# EAGLE design UKHASnet-avr-sensor (EAGLE 6.5.0)
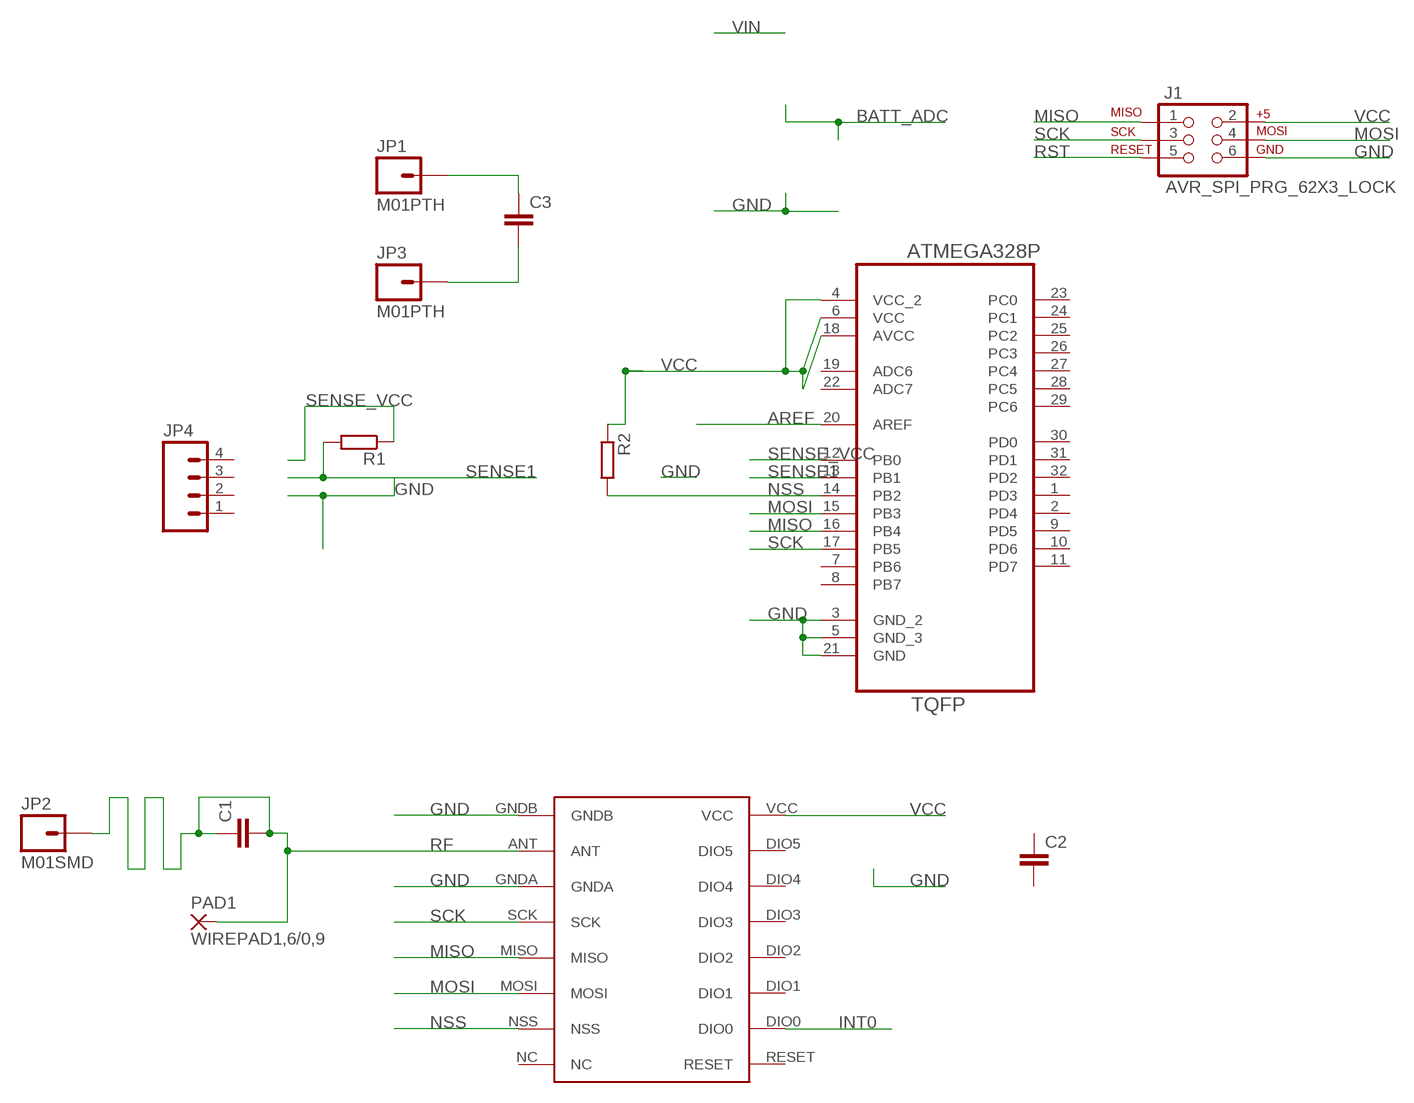
[diagram p0: schematic, sheet 1]

## Parts
C1  C-EUC0402  [C0402]
C2  C-EUC0402  [C0402]
C3  C-EUC0402  [C0402]
J1  AVR_SPI_PRG_62X3_LOCK  [2X3_LOCK]
JP1  M01PTH  [1X01]
JP2  M01SMD  [LUXEON-PAD]
JP3  M01PTH  [1X01]
JP4  M04PTH  [1X04]
PAD1  WIREPAD1,6/0,9  [1,6/0,9]
R1  R-EU_R0402  [R0402]
R2  R-EU_R0402  [R0402]
U2  ATMEGA328P-AU  [QFP80P900X900X120-32N]
U$1  RFM69HW  [RFM]

## Nets
AREF: U2.20(AREF)
GND: C3.2 J1.6 JP3.1 U2.3(GND_2) U2.5(GND_3) U2.21(GND) U$1.GNDA U$1.GNDB
INT0: U$1.DIO0
MISO: J1.1 U2.16(PB4) U$1.MISO
MOSI: J1.4 U2.15(PB3) U$1.MOSI
NSS: R2.2 U2.14(PB2) U$1.NSS
RF [RF]: C1.1 C1.2 JP2.P$1 PAD1.1(P) U$1.ANT
RST: J1.5
SCK: J1.3 U2.17(PB5) U$1.SCK
SENSE1: R1.2 U2.13(PB1)
SENSE_VCC: R1.1 U2.12(PB0)
VCC: C3.1 J1.2 JP1.1 R2.1 U2.4(VCC_2) U2.6(VCC) U2.18(AVCC) U$1.VCC
Unconnected: C2.1 C2.2 JP4.1 JP4.2 JP4.3 JP4.4 U2.1(PD3) U2.2(PD4) U2.7(PB6) U2.8(PB7) U2.9(PD5) U2.10(PD6) U2.11(PD7) U2.19(ADC6) U2.22(ADC7) U2.23(PC0) U2.24(PC1) U2.25(PC2) U2.26(PC3) U2.27(PC4) U2.28(PC5) U2.29(PC6) U2.30(PD0) U2.31(PD1) U2.32(PD2) U$1.DIO1 U$1.DIO2 U$1.DIO3 U$1.DIO4 U$1.DIO5 U$1.NC U$1.RESET

## Library data of the parts
C1 C2 = resistor:C-EU: CAPACITOR, European symbol
C3 = rcl:C-EU: CAPACITOR, European symbol
J1 = SparkFun-Connectors:AVR_SPI_PRG_6: AVR ISP 6 Pin This is the reduced ISP connector for AVR programming. Common on Arduino. This footprint will take up less PCB space and can be used with a 10-pin to 6-pin adapter such as SKU: BOB-08508
JP1-JP3 = SparkFun-Connectors:M01: Header 1 Standard 1-pin 0.1" header. Use with straight break away headers (SKU : PRT-00116), right angle break away headers (PRT-00553), swiss pins (PRT-00743), machine pins (PRT-00117), and female headers (PRT-00115).
JP4 = SparkFun-Connectors:M04: Header 4 Standard 4-pin 0.1" header. Use with straight break away headers (SKU : PRT-00116), right angle break away headers (PRT-00553), swiss pins (PRT-00743), machine pins (PRT-00117), and female headers (PRT-00115). Molex polarized connector foot print use with SKU : PRT-08231 with associated crimp pins and housings. 1MM SMD Version SKU: PRT-10208
PAD1 = wirepad:WIREPAD: Wire PAD connect wire on PCB
R1 R2 = rcl:R-EU_: RESISTOR, European symbol
U2 = Ava:ATMEGA328P-AU; DESCRIPTION: 8-bit Microcontroller with In-System Programmable Flash; MPN: ATMEGA328P-AU; OC_FARNELL: 1715486; OC_NEWARK: 14R4631; PACKAGE: TQFP-32; SUPPLIER: Atmel
U$1 = hopeRF2:RFM69HW

## Net classes
1 RF: clearance 0.635 mm

## Board
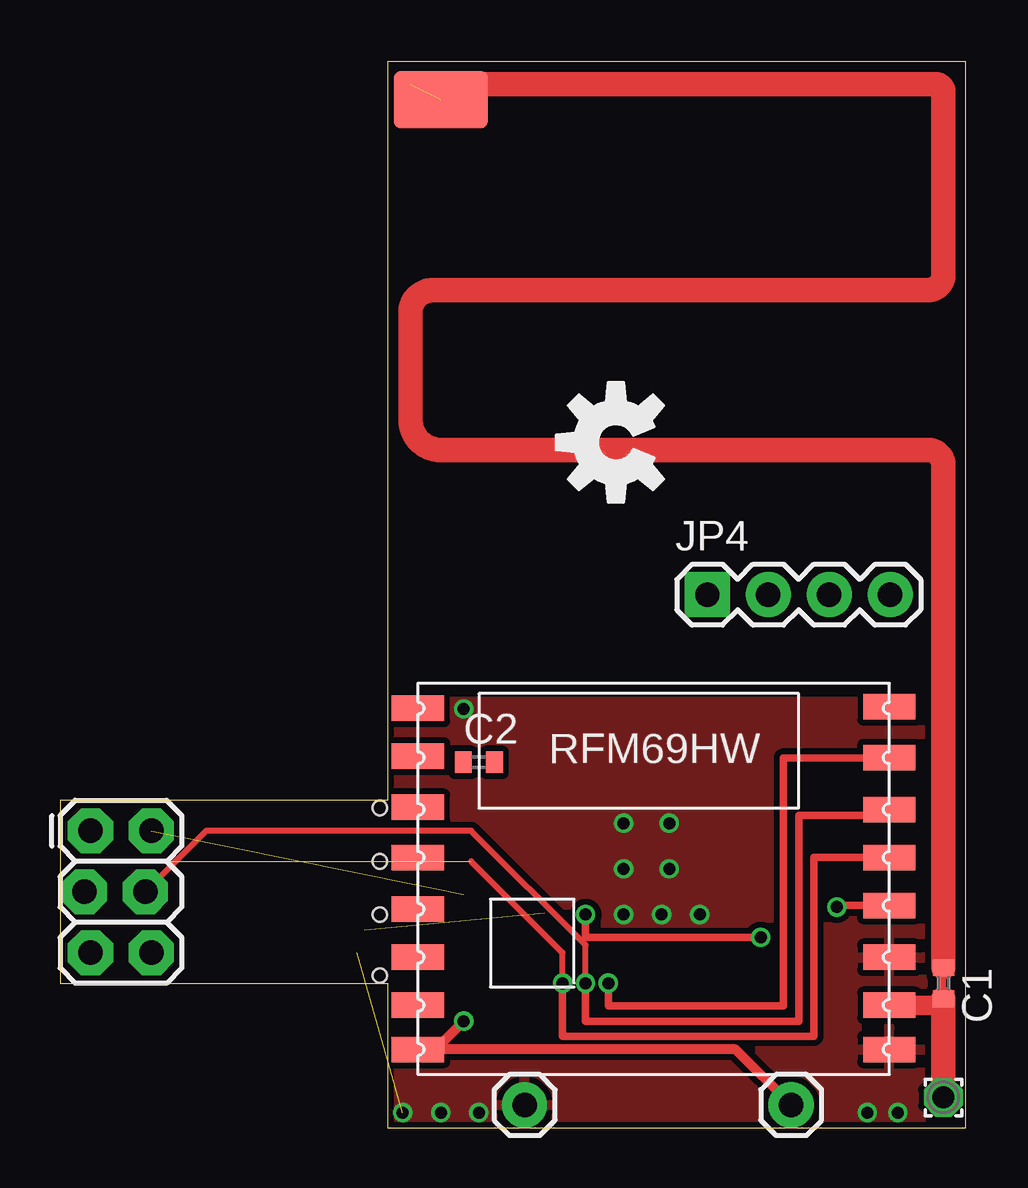
[diagram p1: board, top side]
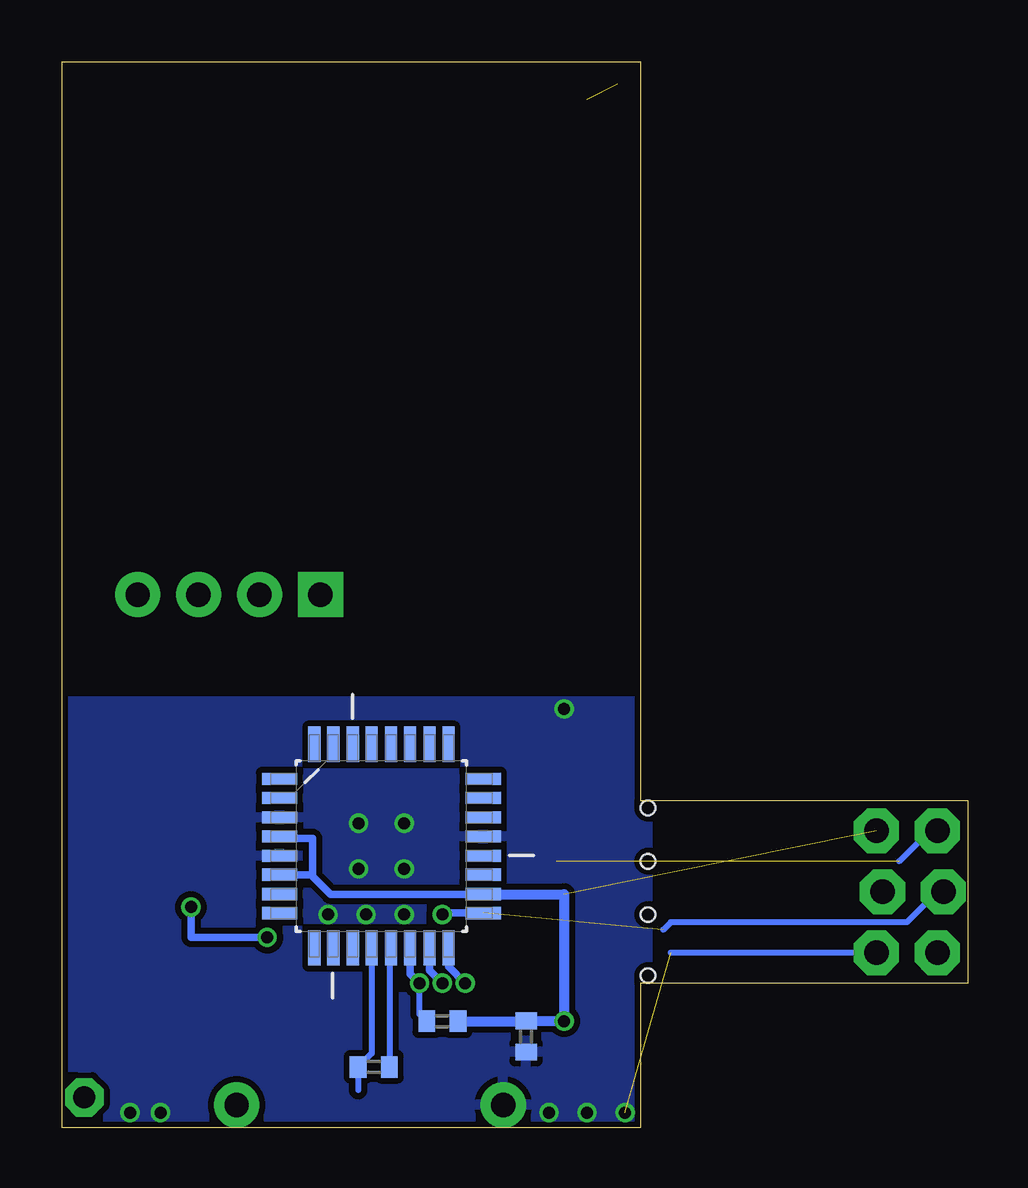
[diagram p2: board, bottom side, seen from below]

Size 37.76 x 44.44 mm. Coordinates in mm from the lower left corner, seen from the top.
Outline: 13.65,0 37.76,0 37.76,44.44 13.65,44.44 13.65,13.65 0,13.65 0,6.03 13.65,6.03 13.65,0
Copper layers (1*16): Top 0.035mm / dielectric 1.5mm / Bottom 0.035mm
Design rules "Hackvana": minimum track width 6mil, minimum drill 0.3mm, track to track 6mil, track to pad 6mil, pad to pad 6mil, via to via 6mil, smd to smd 0mil, copper to edge 6mil, drill to drill 6mil, minimum pad ring 10mil, minimum via ring 6mil, stop-mask expansion 2mil, vias tented up to drill 100mil, thermal gap 10mil
Holes 0.6 mm at 13.34,13.34 13.34,11.11 13.34,8.89 13.34,6.35

### Footprints (pad centres in the part's own frame; a part is rotated, then mirrored left to right if it is on the bottom)
C0402 = smd 0.7 x 0.9: 1 -0.65,0; 2 0.65,0
2X3_LOCK = drill 1.016 pad 1.88 octagon: 1 0,0; 2 0,2.54; 3 2.54,-0.254; 4 2.54,2.286; 5 5.08,0; 6 5.08,2.54
1X01 = drill 1.016 pad 1.88: 1 0,0
LUXEON-PAD = smd 3.9 x 2.4: P$1 0,0
1X04 = drill 1.016 pad 1.88 square: 1 0,0 | drill 1.016 pad 1.88: 2 2.54,0; 3 5.08,0; 4 7.62,0
1,6/0,9 = drill 0.914 pad 1.6 octagon: 1 0,0
R0402 = smd 0.7 x 0.9: 1 -0.65,0; 2 0.65,0
QFP80P900X900X120-32N = smd 1.473 x 0.508: 1 -4.242,2.794; 2 -4.242,2.007; 3 -4.242,1.194; 4 -4.242,0.406; 5 -4.242,-0.406; 6 -4.242,-1.194; 7 -4.242,-2.007; 8 -4.242,-2.794; 17 4.242,-2.794; 18 4.242,-2.007; 19 4.242,-1.194; 20 4.242,-0.406; 21 4.242,0.406; 22 4.242,1.194; 23 4.242,2.007; 24 4.242,2.794 | smd 0.508 x 1.473: 9 -2.794,-4.242; 10 -2.007,-4.242; 11 -1.194,-4.242; 12 -0.406,-4.242; 13 0.406,-4.242; 14 1.194,-4.242; 15 2.007,-4.242; 16 2.794,-4.242; 25 2.794,4.242; 26 2.007,4.242; 27 1.194,4.242; 28 0.406,4.242; 29 -0.406,4.242; 30 -1.194,4.242; 31 -2.007,4.242; 32 -2.794,4.242
RFM = smd 2.184 x 1.067: ANT 19.651,2.889; DIO0 0,13.27; DIO1 0,11.143; DIO2 0,9.047; DIO3 0,6.889; DIO4 0,4.889; DIO5 0,2.889; GNDA 19.651,4.889; GNDB 19.651,1.048; MISO 19.651,9.047; MOSI 19.651,11.047; NC 19.651,15.334; NSS 19.651,13.206; RESET 0,15.27; SCK 19.651,7.048; VCC 0,1.048

### Placement (x,y rotation side)
C1  36.83,6.03 270 top
C2  17.46,15.24 0 top
C3  18.41,3.81 270 bottom
J1  1.27,12.38 270 top
JP1  30.48,0.95 0 top
JP2  15.88,42.86 0 top
JP3  19.37,0.95 0 top
JP4  26.99,22.23 0 top
PAD1  36.83,1.27 0 top
R1  24.76,2.54 0 bottom
R2  21.91,4.45 180 bottom
U2  24.45,11.75 0 bottom
U$1  14.92,2.22 0 top
U$3  [OSHW-LOGO-M]  23.18,28.57 90 top

### Tracks (layer width: path | path; a pad name or v marks a point on that pad's centre or on a via)
GND  (via drill 0.5 pad 0.25)  (1 unrouted)
  Bottom 0.254: J1.6 12.38,7.3
  other vias: 14.29,0.64 16.83,17.46 15.88,0.64 17.46,0.64 34.93,0.64 33.66,0.64 23.49,8.89 25.08,8.89 26.67,8.89 23.49,10.79 25.4,10.79 25.4,12.7 23.49,12.7
  pour Bottom (isolate 0.254): 13.34,17.78 38.1,17.78 38.42,6.03 38.1,5.71 38.1,-0.95 35.88,-0.95 13.34,-2.22
  pour Top (isolate 0.254): 13.34,17.78 38.1,17.78 38.42,-2.54 13.34,-1.59
MISO  (via drill 0.5)  (1 unrouted)
  Top 0.254: v20.95,6.03 20.95,7.3 17.14,11.11
  Top 0.305: U$1.MISO 31.43,11.27 31.43,3.81 20.95,3.81 v20.95,6.03
  Bottom 0.254: J1.1 1.59,12.38 2.86,11.11
  Bottom 0.305: U2.16 21.65,6.73 v20.95,6.03
MOSI  (via drill 0.5)
  Top 0.254: v21.91,6.03 21.91,7.62 17.14,12.38 6.1,12.38 J1.4
  Top 0.305: v21.91,6.03 21.91,4.45 30.8,4.45 30.8,13.02 34.57,13.02 U$1.MOSI
  Bottom 0.305: U2.15 22.44,6.57 v21.91,6.03
NSS  (via drill 0.5)
  Top 0.305: U$1.NSS 30.16,15.43 30.16,5.08 22.86,5.08 v22.86,6.03
  Bottom 0.254: R2.2 22.86,4.75 v22.86,6.03
  Bottom 0.305: U2.14 23.25,6.43 v22.86,6.03
RF  (1 unrouted)
  Top 0.254: C1.2 C1.1
  Top 0.813: C1.2 36.56,5.11 U$1.ANT
  Top 1.016: PAD1.1 C1.2 | C1.1 36.83,27.62 arc90 36.2,28.26 15.88,28.26 arc-90 14.61,29.53 14.61,33.97 arc-90 15.56,34.92 36.2,34.92 arc90 36.83,35.56 36.83,43.18 arc90 36.51,43.5 14.61,43.5
SCK  (via drill 0.5)  (1 unrouted)
  Top 0.305: U$1.SCK 32.39,9.27 v32.39,9.21 | v29.21,7.94 21.91,7.94 v21.91,8.89
  Bottom 0.254: J1.3 1.27,9.84 2.54,8.57 12.38,8.57 12.7,8.26
  Bottom 0.305: v29.21,7.94 32.39,7.94 v32.39,9.21 | U2.17 21.91,8.95 v21.91,8.89
SENSE1
  Bottom 0.254: U2.13 arc-90 24.11,7.43 R1.2 arc-90 24.13,2.52
SENSE_VCC
  Bottom 0.254: U2.12 24.85,3.1 R1.1 25.41,1.57
VCC  (via drill 0.5 pad 0.25)  (1 unrouted)
  Top 0.406: JP1.1 28.16,3.27 U$1.VCC 15.65,3.27 v16.83,4.45
  Bottom 0.305: U2.4 28.6,12.06 27.3,12.06 27.3,10.48 | 27.3,10.48 27.38,10.55 U2.6 | 27.3,10.48 26.57,9.74 U2.18
  Bottom 0.406: R2.1 18.43,4.45 C3.1 16.84,4.46 v16.83,4.45 16.83,9.74 U2.18

### Text on the board
tDocu: uSensor V1 | Phil M0DNY | +